# EAGLE design extbrd (EAGLE 7.2.0)
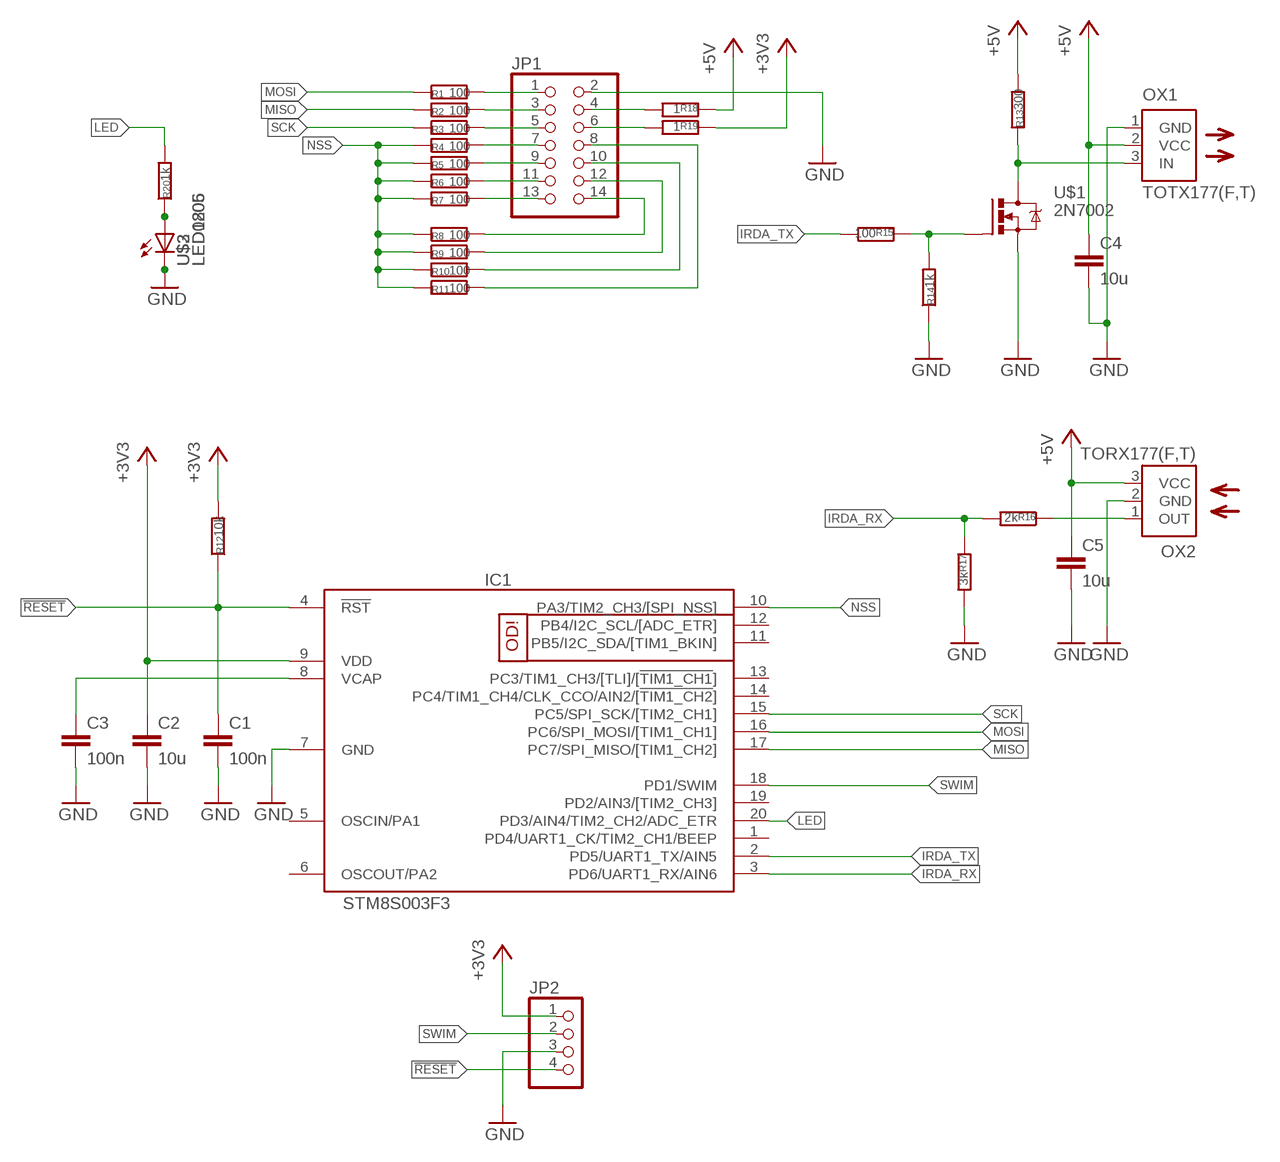
[diagram p0: schematic, sheet 1]

## Parts
C1  100n  CC0603  [C0603]
C2  10u  CC0805  [C0805]
C3  100n  CC0603  [C0603]
C4  10u  CC0805  [C0805]
C5  10u  CC0805  [C0805]
IC1  STM8S003F3  [TSSOP20]
JP1  PINHD-2X07_2.54-SMD  [2X07SMD]
JP2  PINHD-1X04_2.54-SMD  [1X04SMD]
OX1  TOTX177(F,T)  [TOTX]
OX2  TORX177(F,T)  [TORX]
R1  100  R0603  [0603]
R2  100  R0603  [0603]
R3  100  R0603  [0603]
R4  100  R0603  [0603]
R5  100  R0603  [0603]
R6  100  R0603  [0603]
R7  100  R0603  [0603]
R8  100  R0603  [0603]
R9  100  R0603  [0603]
R10  100  R0603  [0603]
R11  100  R0603  [0603]
R12  10k  R0603  [0603]
R13  300  R0603  [0603]
R14  1k  R0603  [0603]
R15  100  R0603  [0603]
R16  2k  R0603  [0603]
R17  3k  R0603  [0603]
R18  1  R0603  [0603]
R19  1  R0603  [0603]
R20  1k  R0603  [0603]
U$1  2N7002  [SOT23]
U$2  LED0805  [0805-LED]
U$3  LED1206  [1206-LED]

## Nets
!RESET: C1.1 IC1.4(!RST) JP2.4 R12.1
+3V3: C2.1 IC1.9(VDD) JP2.1 R12.2 R19.1
+5V: C4.1 C5.1 OX1.2(VCC) OX2.3(VCC) R13.2 R18.1
GND: C1.2 C2.2 C3.2 C4.2 C5.2 IC1.7(GND) JP1.2 JP2.3 OX1.1(GND) OX2.2(GND) R14.1 R17.2 U$1.2(S) U$2.C U$3.C
IRDA_RX: IC1.3(PD6/UART1_RX/AIN6) R16.2 R17.1
IRDA_TX: IC1.2(PD5/UART1_TX/AIN5) R15.2
LED: IC1.20(PD3/AIN4/TIM2_CH2/ADC_ETR) R20.2
MISO: IC1.17(PC7/SPI_MISO/[TIM1_CH2]) R2.1
MOSI: IC1.16(PC6/SPI_MOSI/[TIM1_CH1]) R1.1
N$1: JP1.5 R3.2
N$2: JP1.3 R2.2
N$3: JP1.1 R1.2
N$4: JP1.4 R18.2
N$5: JP1.7 R4.2
N$6: JP1.9 R5.2
N$7: JP1.11 R6.2
N$8: JP1.13 R7.2
N$9: JP1.14 R8.2
N$10: JP1.12 R9.2
N$11: JP1.10 R10.2
N$12: JP1.8 R11.2
N$13: C3.1 IC1.8(VCAP)
N$15: OX1.3(IN) R13.1 U$1.3(D)
N$16: JP1.6 R19.2
N$17: R14.2 R15.1 U$1.1(G)
N$18: R20.1 U$2.A U$3.A
N$21: OX2.1(OUT) R16.1
NSS: IC1.10(PA3/TIM2_CH3/[SPI_NSS]) R4.1 R5.1 R6.1 R7.1 R8.1 R9.1 R10.1 R11.1
SCK: IC1.15(PC5/SPI_SCK/[TIM2_CH1]) R3.1
SWIM: IC1.18(PD1/SWIM) JP2.2
Unconnected: IC1.1(PD4/UART1_CK/TIM2_CH1/BEEP) IC1.5(OSCIN/PA1) IC1.6(OSCOUT/PA2) IC1.11(PB5/I2C_SDA/[TIM1_BKIN]) IC1.12(PB4/I2C_SCL/[ADC_ETR]) IC1.13(PC3/TIM1_CH3/[TLI]/[!TIM1_CH1!]) IC1.14(PC4/TIM1_CH4/CLK_CCO/AIN2/[!TIM1_CH2!]) IC1.19(PD2/AIN3/[TIM2_CH3])

## Library data of the parts
C1-C5 = CasaLibrary:C: Capacitor
IC1 = stm8:STM8S003: Value line, 16 MHz STM8S 8-bit MCU, 8 Kbytes Flash, 128 bytes data EEPROM, 10-bit ADC, 3 timers, UART, SPI, I2C
JP1 = pinhead-2:PINHD-2X07: PIN HEADER
JP2 = pinhead-2:PINHD-1X04: PIN HEADER
OX1 = CasaLibrary:TOTX177(F,T): FIBER OPTIC TRANSMITTING MODULE
OX2 = CasaLibrary:TORX177(F,T): FIBER OPTIC RECEIVING MODULE
R1-R20 = CasaLibrary:R
U$1 = CasaLibrary:2N7002
U$2 U$3 = CasaLibrary:LED

## Board
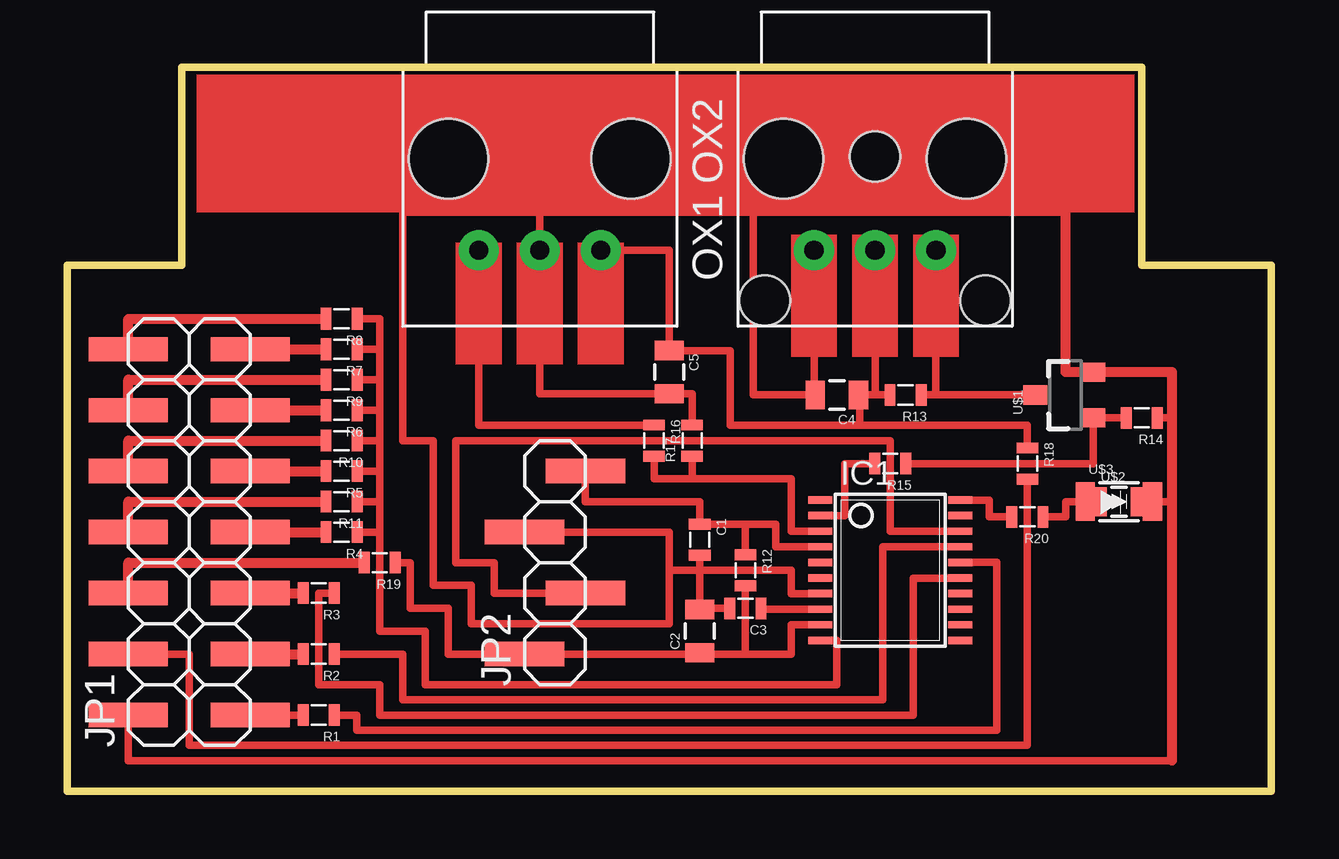
[diagram p1: board, top side]

Size 50.16 x 30.16 mm. Coordinates in mm from the lower left corner, seen from the top.
Outline: 0,21.91 4.76,21.91 4.76,30.16 44.77,30.16 44.77,21.91 50.16,21.91 50.16,0 0,0 0,21.91
Copper layers (1*16): Top 0.035mm / dielectric 1.5mm / Bottom 0.035mm
Design rules "my02": minimum track width 0.2mm, minimum drill 0.2mm, track to track 0.2mm, track to pad 0.2mm, pad to pad 0.2mm, via to via 0.2mm, smd to smd 0.2mm, copper to edge 40mil, drill to drill 8mil, minimum pad ring 10mil, minimum via ring 8mil, stop-mask expansion 4mil, vias tented up to drill 0mil, thermal gap 10mil

### Footprints (pad centres in the part's own frame; a part is rotated, then mirrored left to right if it is on the bottom)
C0603 = smd 0.45 x 0.9: 1 -0.65,0; 2 0.65,0
C0805 = smd 0.8 x 1.2: 1 -0.9,0; 2 0.9,0
TSSOP20 = smd 0.305 x 0.991: 1 -2.925,-2.918; 2 -2.275,-2.918; 3 -1.625,-2.918; 4 -0.975,-2.918; 5 -0.325,-2.918; 6 0.325,-2.918; 7 0.975,-2.918; 8 1.625,-2.918; 9 2.275,-2.918; 10 2.925,-2.918; 11 2.925,2.918; 12 2.275,2.918; 13 1.625,2.918; 14 0.975,2.918; 15 0.325,2.918; 16 -0.325,2.918; 17 -0.975,2.918; 18 -1.625,2.918; 19 -2.275,2.918; 20 -2.925,2.918
2X07SMD = smd 1.016 x 3.302: 1 -1.27,-3.81; 2 -1.27,1.27; 3 1.27,-3.81; 4 1.27,1.27; 5 3.81,-3.81; 6 3.81,1.27; 7 6.35,-3.81; 8 6.35,1.27; 9 8.89,-3.81; 10 8.89,1.27; 11 11.43,-3.81; 12 11.43,1.27; 13 13.97,-3.81; 14 13.97,1.27
1X04SMD = smd 1.016 x 3.302: 1 -1.27,1.27; 2 1.27,-1.27; 3 3.81,1.27; 4 6.35,-1.27
TOTX = drill 0.8 pad 1.676: 1 -3.81,2.54; 2 -3.81,0; 3 -3.81,-2.54 | hole 3.3: 0,-3.81; 0,3.81 | hole 2.1: 0.09,0; -5.91,4.6; -5.91,-4.6
TORX = drill 0.8 pad 1.676: 1 3.81,-2.54; 2 3.81,0; 3 3.81,2.54 | hole 3.3: 0,3.81; 0,-3.81
0603 = smd 0.45 x 0.9: 1 -0.65,0; 2 0.65,0
SOT23 = smd 0.8 x 1: 1 -0.95,-1.159; 2 0.95,-1.159; 3 0,1.259
0805-LED = smd 0.8 x 1.2: A -0.9,0; C 0.9,0
1206-LED = smd 0.8 x 1.6: A -1.4,0; C 1.4,0

### Placement (x,y rotation side)
C1  26.35,10.48 270 top
C2  26.35,6.67 90 top
C3  28.26,7.62 180 top
C4  32.07,16.51 180 top
C5  25.08,17.46 270 top
IC1  34.29,9.21 270 top
JP1  3.81,4.45 90 top
JP2  20.32,6.98 90 top
OX1  33.66,26.35 90 top
OX2  19.68,26.35 270 top
R1  10.48,3.18 180 top
R2  10.48,5.71 180 top
R3  10.48,8.25 180 top
R4  11.43,10.8 180 top
R5  11.43,13.34 180 top
R6  11.43,15.88 180 top
R7  11.43,18.41 180 top
R8  11.43,19.69 180 top
R9  11.43,17.15 180 top
R10  11.43,14.61 180 top
R11  11.43,12.07 180 top
R12  28.26,9.21 270 top
R13  34.92,16.51 180 top
R14  44.77,15.56 180 top
R15  34.29,13.65 180 top
R16  24.45,14.61 270 top
R17  26.04,14.61 90 top
R18  40.01,13.65 270 top
R19  13.02,9.53 180 top
R20  40.01,11.43 180 top
U$1  41.59,16.51 90 top
U$2  43.81,12.07 0 top
U$3  43.81,12.07 0 top

### Tracks (layer width: path | path; a pad name or v marks a point on that pad's centre or on a via)
!RESET
  Top 0.305: IC1.4 29.53,10.18 29.53,11.13 28.26,11.13 | JP2.4 21.59,12.07 26.35,12.07 C1.1 28.26,11.13 | R12.1 28.26,11.13
+3V3
  Top 0.305: 28.26,5.71 30.16,5.71 30.16,6.93 IC1.9 | 28.26,5.71 26.35,5.71 | 26.35,5.71 JP2.1 15.88,5.71 15.88,7.62 14.29,7.62 14.29,9.53 R19.1 | R12.2 28.26,5.71 | C2.1 26.35,5.71
+5V
  Top 0.305: 33.02,15.24 27.62,15.24 27.62,18.36 C5.1 25.08,22.54 OX2.3 | 33.02,16.51 33.02,15.56 33.02,15.24 | OX1.2 33.66,16.51 | 33.66,16.51 33.02,16.51 | 33.66,16.51 R13.2 | C4.1 33.02,16.51 | R18.1 40.01,15.24 33.02,15.24
GND
  Top 0.305: 26.35,9.21 26.35,7.62 | IC1.7 30.16,8.23 30.16,9.21 26.35,9.21 | JP2.3 25.08,10.8 25.08,9.21 | C3.2 26.35,7.62 | 26.35,9.21 C1.2 26.35,9.84 | 19.68,24.13 13.97,24.13 13.97,14.6 15.24,14.6 15.24,8.57 16.83,8.57 16.83,6.98 25.08,6.98 25.08,9.21 | 25.08,9.21 26.35,9.21 | OX2.2 19.68,18.1 | 26.35,7.62 C2.2 | OX1.1 31.11,16.51 C4.2 28.57,16.51 28.57,24.13 | JP1.2 2.54,1.27 46.04,1.27 | U$1.2 46.04,17.46 | R14.1 46.04,15.56 | U$2.C U$3.C 46.04,12.07 | 41.59,24.13 28.57,24.13 | 19.68,24.13 19.68,23.18 19.68,16.56 C5.2 26.04,16.56 R17.2 | 19.68,24.13 28.57,24.13
  Top 0.406: 46.04,1.27 46.04,12.07 46.04,15.56 46.04,17.46 41.59,17.46 41.59,24.13 | 19.68,23.18 OX2.2
IRDA_RX
  Top 0.305: R16.2 24.45,13.02 26.04,13.02 | 26.04,13.02 R17.1 | IC1.3 30.16,10.83 30.16,13.02 26.04,13.02
IRDA_TX
  Top 0.305: IC1.2 32.38,11.48 32.38,13.65 R15.2
LED
  Top 0.305: IC1.20 38.42,12.13 38.42,11.43 R20.2
MISO
  Top 0.305: IC1.17 33.97,10.18 33.97,3.81 13.97,3.81 13.97,5.71 R2.1
MOSI
  Top 0.305: IC1.16 38.73,9.53 38.73,2.54 12.06,2.54 12.06,3.18 R1.1
N$1
  Top 0.406: JP1.5 R3.2
N$2
  Top 0.406: JP1.3 R2.2
N$3
  Top 0.305: JP1.1 R1.2
N$4
  Top 0.305: JP1.4 5.08,5.71 5.08,1.91 40.01,1.91 R18.2
N$5
  Top 0.406: JP1.7 R4.2
N$6
  Top 0.406: JP1.9 R5.2
N$7
  Top 0.406: JP1.11 R6.2
N$8
  Top 0.406: JP1.13 R7.2
N$9
  Top 0.406: JP1.14 2.54,19.69 R8.2
N$10
  Top 0.406: JP1.12 2.54,17.15 R9.2
N$11
  Top 0.406: JP1.10 2.54,14.6 R10.2
N$12
  Top 0.406: JP1.8 2.54,12.07 R11.2
N$13
  Top 0.305: C3.1 28.89,7.62 28.89,7.58 IC1.8
N$14  (via drill 0.6)
  other vias: 15.88,26.35
N$15
  Top 0.305: R13.1 36.2,16.51 | 36.2,16.51 OX1.3 | 36.2,16.51 U$1.3
N$16
  Top 0.406: JP1.6 2.54,9.53 R19.2
N$17
  Top 0.305: R15.1 42.75,13.65 U$1.1 R14.2
N$18
  Top 0.305: R20.1 41.59,11.43 41.59,12.07 U$3.A U$2.A
N$19  (via drill 0.6)
  other vias: 23.5,26.35
N$20  (via drill 0.6)
  other vias: 29.84,26.35
N$21
  Top 0.305: R16.1 23.5,15.24 17.14,15.24 OX2.1
N$22  (via drill 0.6)
  other vias: 37.47,26.35
N$23
  Top 0.305: 19.68,29.21 19.68,26.67 | 19.68,26.35 19.37,26.67 | 19.37,26.67 19.05,26.99 19.68,26.99 | 20,26.99 20.32,26.99 19.68,26.35 | 19.68,26.35 19.68,26.67 | 19.68,26.67 20,26.99 | 20,26.99 19.68,26.99 | 19.68,26.99 19.37,26.67
N$24
  Top 0.305: 33.66,26.35 33.66,28.89 | 33.66,29.21 33.34,28.89 | 33.34,28.89 33.02,28.58 33.66,28.58 | 33.97,28.58 34.29,28.58 33.66,29.21 | 33.66,29.21 33.66,28.89 | 33.66,28.89 33.97,28.58 | 33.97,28.58 33.66,28.58 | 33.66,28.58 33.34,28.89
N$25
  Top 0.305: 0,21.91 4.76,21.91 4.76,30.16 44.77,30.16 44.77,21.91 50.16,21.91 50.16,0 0,0 0,21.91
NSS
  Top 0.305: R4.1 13.02,10.8 | 13.02,10.8 13.02,12.07 | R11.1 13.02,12.07 | 13.02,12.07 13.02,13.34 | R5.1 13.02,13.34 | 13.02,13.34 13.02,14.6 | R10.1 13.02,14.6 | 13.02,14.6 13.02,15.87 | R6.1 13.02,15.87 | 13.02,15.87 13.02,17.15 | R9.1 13.02,17.15 | 13.02,17.15 13.02,18.41 | R7.1 13.02,18.41 | 13.02,18.41 13.02,19.69 R8.1 | IC1.10 32.07,6.28 32.07,4.44 14.92,4.44 14.92,6.67 13.02,6.67 13.02,10.8
SCK
  Top 0.305: IC1.15 35.24,8.88 35.24,3.18 13.02,3.18 13.02,4.44 10.48,4.44 10.48,8.25 R3.1
SWIM
  Top 0.305: IC1.18 34.29,10.83 34.29,14.6 16.19,14.6 16.19,9.53 17.78,9.53 17.78,8.25 JP2.2
(copper drawn outside any net)
  shapes: Top area x14